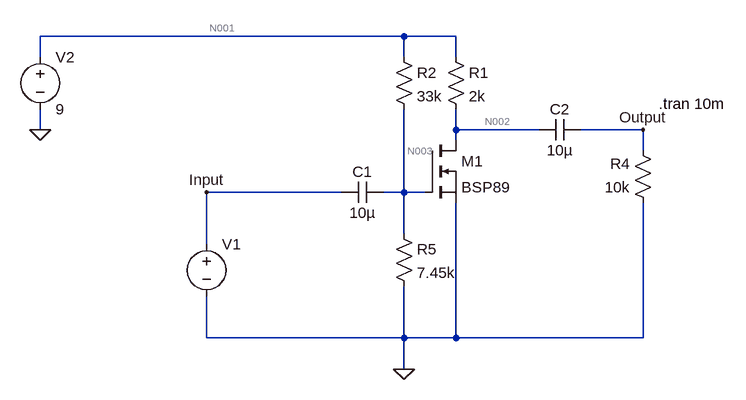
[diagram p0: schematic CS Amplifier.asc]
CS Amplifier.asc, the LTspice schematic file:
Version 4.1
SHEET 1 880 680
WIRE 112 -32 -448 -32
WIRE 192 -32 112 -32
WIRE -448 0 -448 -32
WIRE 112 0 112 -32
WIRE 192 0 192 -32
WIRE -448 112 -448 80
WIRE 192 112 192 80
WIRE 320 112 192 112
WIRE 480 112 384 112
WIRE 192 128 192 112
WIRE 480 144 480 112
WIRE 16 208 -192 208
WIRE 112 208 112 80
WIRE 112 208 80 208
WIRE 144 208 112 208
WIRE 112 272 112 208
WIRE -192 288 -192 208
WIRE -192 432 -192 368
WIRE 112 432 112 352
WIRE 112 432 -192 432
WIRE 192 432 192 224
WIRE 192 432 112 432
WIRE 480 432 480 224
WIRE 480 432 192 432
WIRE 112 480 112 432
FLAG -448 112 0
FLAG 112 480 0
FLAG -192 208 Input
FLAG 480 112 Output
SYMBOL res 176 -16 R0
SYMATTR InstName R1
SYMATTR Value 2k
SYMBOL res 496 240 R180
WINDOW 0 36 76 Left 2
WINDOW 3 36 40 Left 2
SYMATTR InstName R4
SYMATTR Value 10k
SYMBOL cap 80 192 R90
WINDOW 0 0 32 VBottom 2
WINDOW 3 32 32 VTop 2
SYMATTR InstName C1
SYMATTR Value 10µ
SYMBOL cap 384 96 R90
WINDOW 0 0 32 VBottom 2
WINDOW 3 32 32 VTop 2
SYMATTR InstName C2
SYMATTR Value 10µ
SYMBOL res 96 -16 R0
SYMATTR InstName R2
SYMATTR Value 33k
SYMBOL res 96 256 R0
SYMATTR InstName R5
SYMATTR Value 7.45k
SYMBOL voltage -192 272 R0
WINDOW 3 24 96 Invisible 2
WINDOW 39 0 0 Left 0
SYMATTR Value SINE(0 10m 1k 0 0 0 1k)
SYMATTR InstName V1
SYMATTR Value2 AC 1
SYMBOL voltage -448 -16 R0
WINDOW 123 0 0 Left 0
WINDOW 39 0 0 Left 0
SYMATTR InstName V2
SYMATTR Value 9
SYMBOL nmos 144 128 R0
SYMATTR InstName M1
SYMATTR Value BSP89
TEXT 504 72 Left 2 !.tran 10m

The netlist it stands for:
* CS Amplifier.asc
R1 N001 N002 2k
R4 0 Output 10k
C1 N003 Input 10µ
C2 Output N002 10µ
R2 N001 N003 33k
R5 N003 0 7.45k
V1 Input 0 SINE(0 10m 1k 0 0 0 1k) AC 1
V2 N001 0 9
M1 N002 N003 0 0 BSP89
.model NMOS NMOS
.model PMOS PMOS
.lib standard.mos
.tran 10m
.backanno
.end

* Results of the author's LTspice run, read from the files saved beside the schematic
* Operating Point, zero values left out:
*   V(n002) = 1.998 V
*   V(n003) = 1.658 V
*   V(n001) = 9 V
*   I(R2) = 222.5 µA
*   I(R5) = 222.5 µA
*   I(R1) = 3.501 mA
*   I(V2) = -3.724 mA
*   Id(M1) = 3.501 mA
*   Is(M1) = -3.501 mA
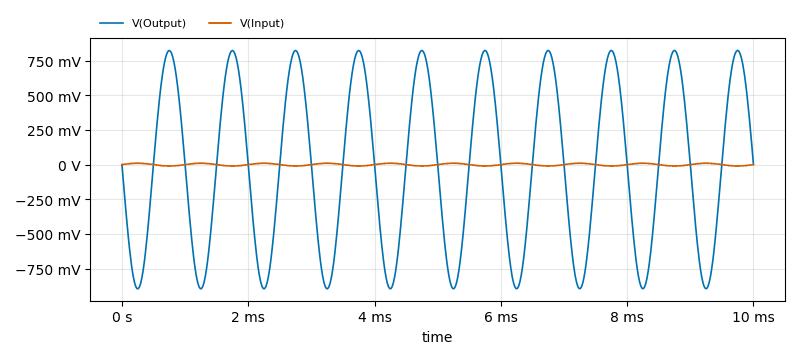
[diagram p1: Transient Analysis of CS Amplifier.asc, plotted from the saved traces]
* Transient Analysis, 1 run:
*   V(Output): min -896.4 mV, max 824.8 mV, average -16.23 mV, rms 608.9 mV, last 2.535 mV
*   V(Input): min -10 mV, max 9.995 mV, average 1.009 µV, rms 7.071 mV, last 0 V